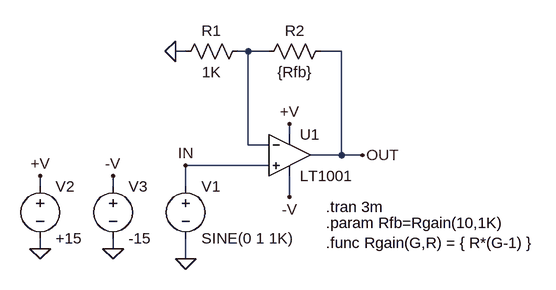
[diagram p0: schematic param.asc]
param.asc, the LTspice schematic file:
Version 4
SHEET 1 1192 756
WIRE 384 368 384 352
WIRE 384 464 384 448
WIRE 496 368 496 352
WIRE 496 464 496 448
WIRE 608 160 592 160
WIRE 608 368 608 336
WIRE 608 480 608 448
WIRE 704 160 688 160
WIRE 704 304 704 160
WIRE 736 160 704 160
WIRE 736 304 704 304
WIRE 736 336 608 336
WIRE 768 288 768 272
WIRE 768 384 768 352
WIRE 848 160 816 160
WIRE 848 320 800 320
WIRE 848 320 848 160
WIRE 880 320 848 320
FLAG 608 480 0
FLAG 592 160 0
FLAG 768 272 +V
FLAG 384 352 +V
FLAG 768 384 -V
FLAG 496 352 -V
FLAG 384 464 0
FLAG 496 464 0
FLAG 880 320 OUT
FLAG 608 336 IN
SYMBOL res 704 144 R90
WINDOW 0 0 56 VBottom 0
WINDOW 3 32 56 VTop 0
SYMATTR InstName R1
SYMATTR Value 1K
SYMBOL voltage 608 352 R0
SYMATTR InstName V1
SYMATTR Value SINE(0 1 1K)
SYMBOL opamps\\LT1001 768 256 R0
SYMATTR InstName U1
SYMBOL res 832 144 R90
WINDOW 0 0 56 VBottom 0
WINDOW 3 32 56 VTop 0
SYMATTR InstName R2
SYMATTR Value {Rfb}
SYMBOL voltage 384 352 R0
SYMATTR InstName V2
SYMATTR Value +15
SYMBOL voltage 496 352 R0
SYMATTR InstName V3
SYMATTR Value -15
TEXT 824 400 Left 0 !.tran 3m
TEXT 824 424 Left 0 !.param Rfb=Rgain(10,1K)\n.func Rgain(G,R) = { R*(G-1) }

The netlist it stands for:
* param.asc
R1 N001 0 1K
V1 IN 0 SINE(0 1 1K)
XU1 IN N001 +V -V OUT LT1001  ; pins In+ In- V+ V- OUT
R2 OUT N001 {Rfb}
V2 +V 0 +15
V3 -V 0 -15
.tran 3m
.param Rfb=Rgain(10,1K)
.func Rgain(G,R) = { R*(G-1) }
.lib LTC.lib
.backanno
.end